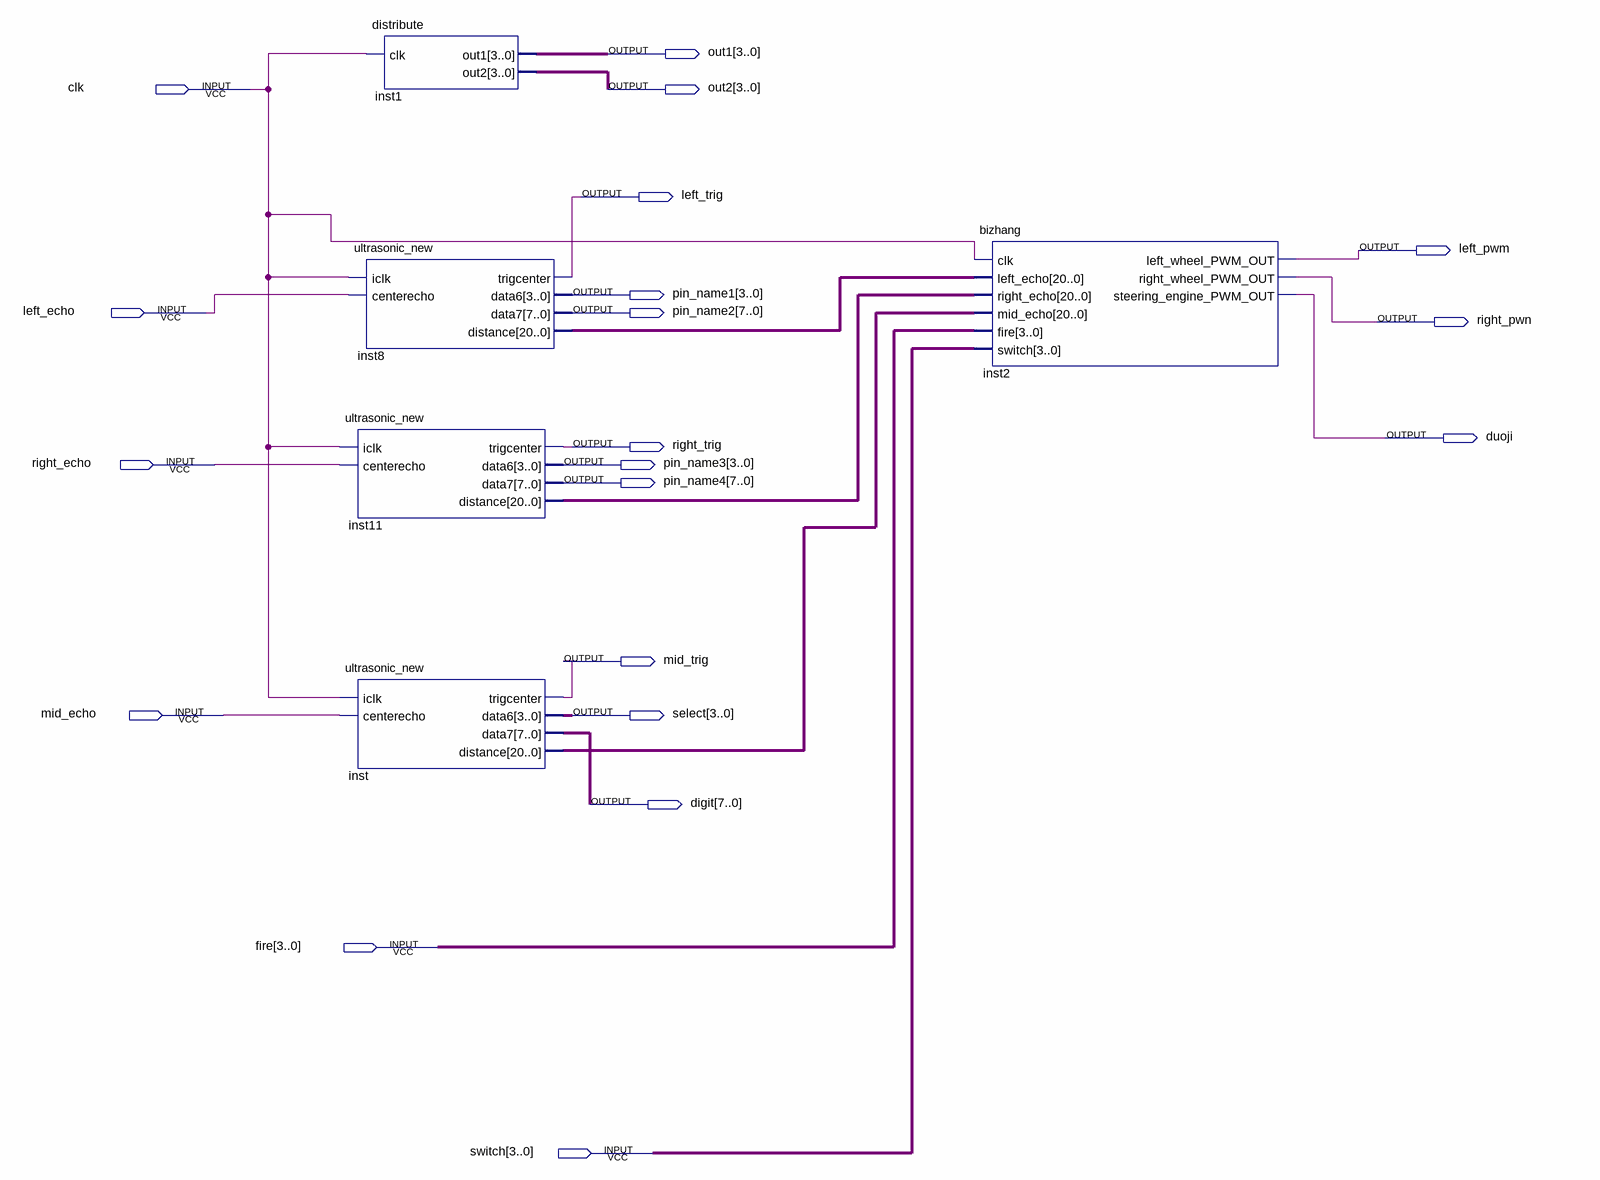
[diagram p0: schematic sheet]
// Quartus schematic car.bdf as structural Verilog: 5 symbols, 20 pins
module car (
  input  clk,
  input  left_echo,
  input  right_echo,
  input  mid_echo,
  input  [3:0] fire,
  input  [3:0] switch,
  output [3:0] out1,
  output [3:0] out2,
  output left_trig,
  output left_pwm,
  output [3:0] pin_name1,
  output [7:0] pin_name2,
  output right_pwn,
  output duoji,
  output right_trig,
  output [3:0] pin_name3,
  output [7:0] pin_name4,
  output mid_trig,
  output [3:0] select,
  output [7:0] digit
);

  wire [20:0] inst8_distance, inst11_distance, inst_distance;

  distribute inst1 (.clk(clk), .out1(out1), .out2(out2));
  ultrasonic_new inst8 (
    .iclk(clk), .centerecho(left_echo), .trigcenter(left_trig), .data6(pin_name1), .data7(pin_name2),
    .distance(inst8_distance));
  ultrasonic_new inst11 (
    .iclk(clk), .centerecho(right_echo), .trigcenter(right_trig), .data6(pin_name3), .data7(pin_name4),
    .distance(inst11_distance));
  ultrasonic_new inst (
    .iclk(clk), .centerecho(mid_echo), .trigcenter(mid_trig), .data6(select), .data7(digit),
    .distance(inst_distance));
  bizhang inst2 (
    .clk(clk), .left_echo(inst8_distance), .right_echo(inst11_distance), .mid_echo(inst_distance),
    .fire(fire), .switch(switch), .left_wheel_PWM_OUT(left_pwm), .right_wheel_PWM_OUT(right_pwn),
    .steering_engine_PWM_OUT(duoji));
endmodule
